# Altium schematic sheet [03] - POWER.SchDoc
size A3; DocumentNumber: 3; SheetNumber: 3; SheetTotal: 5
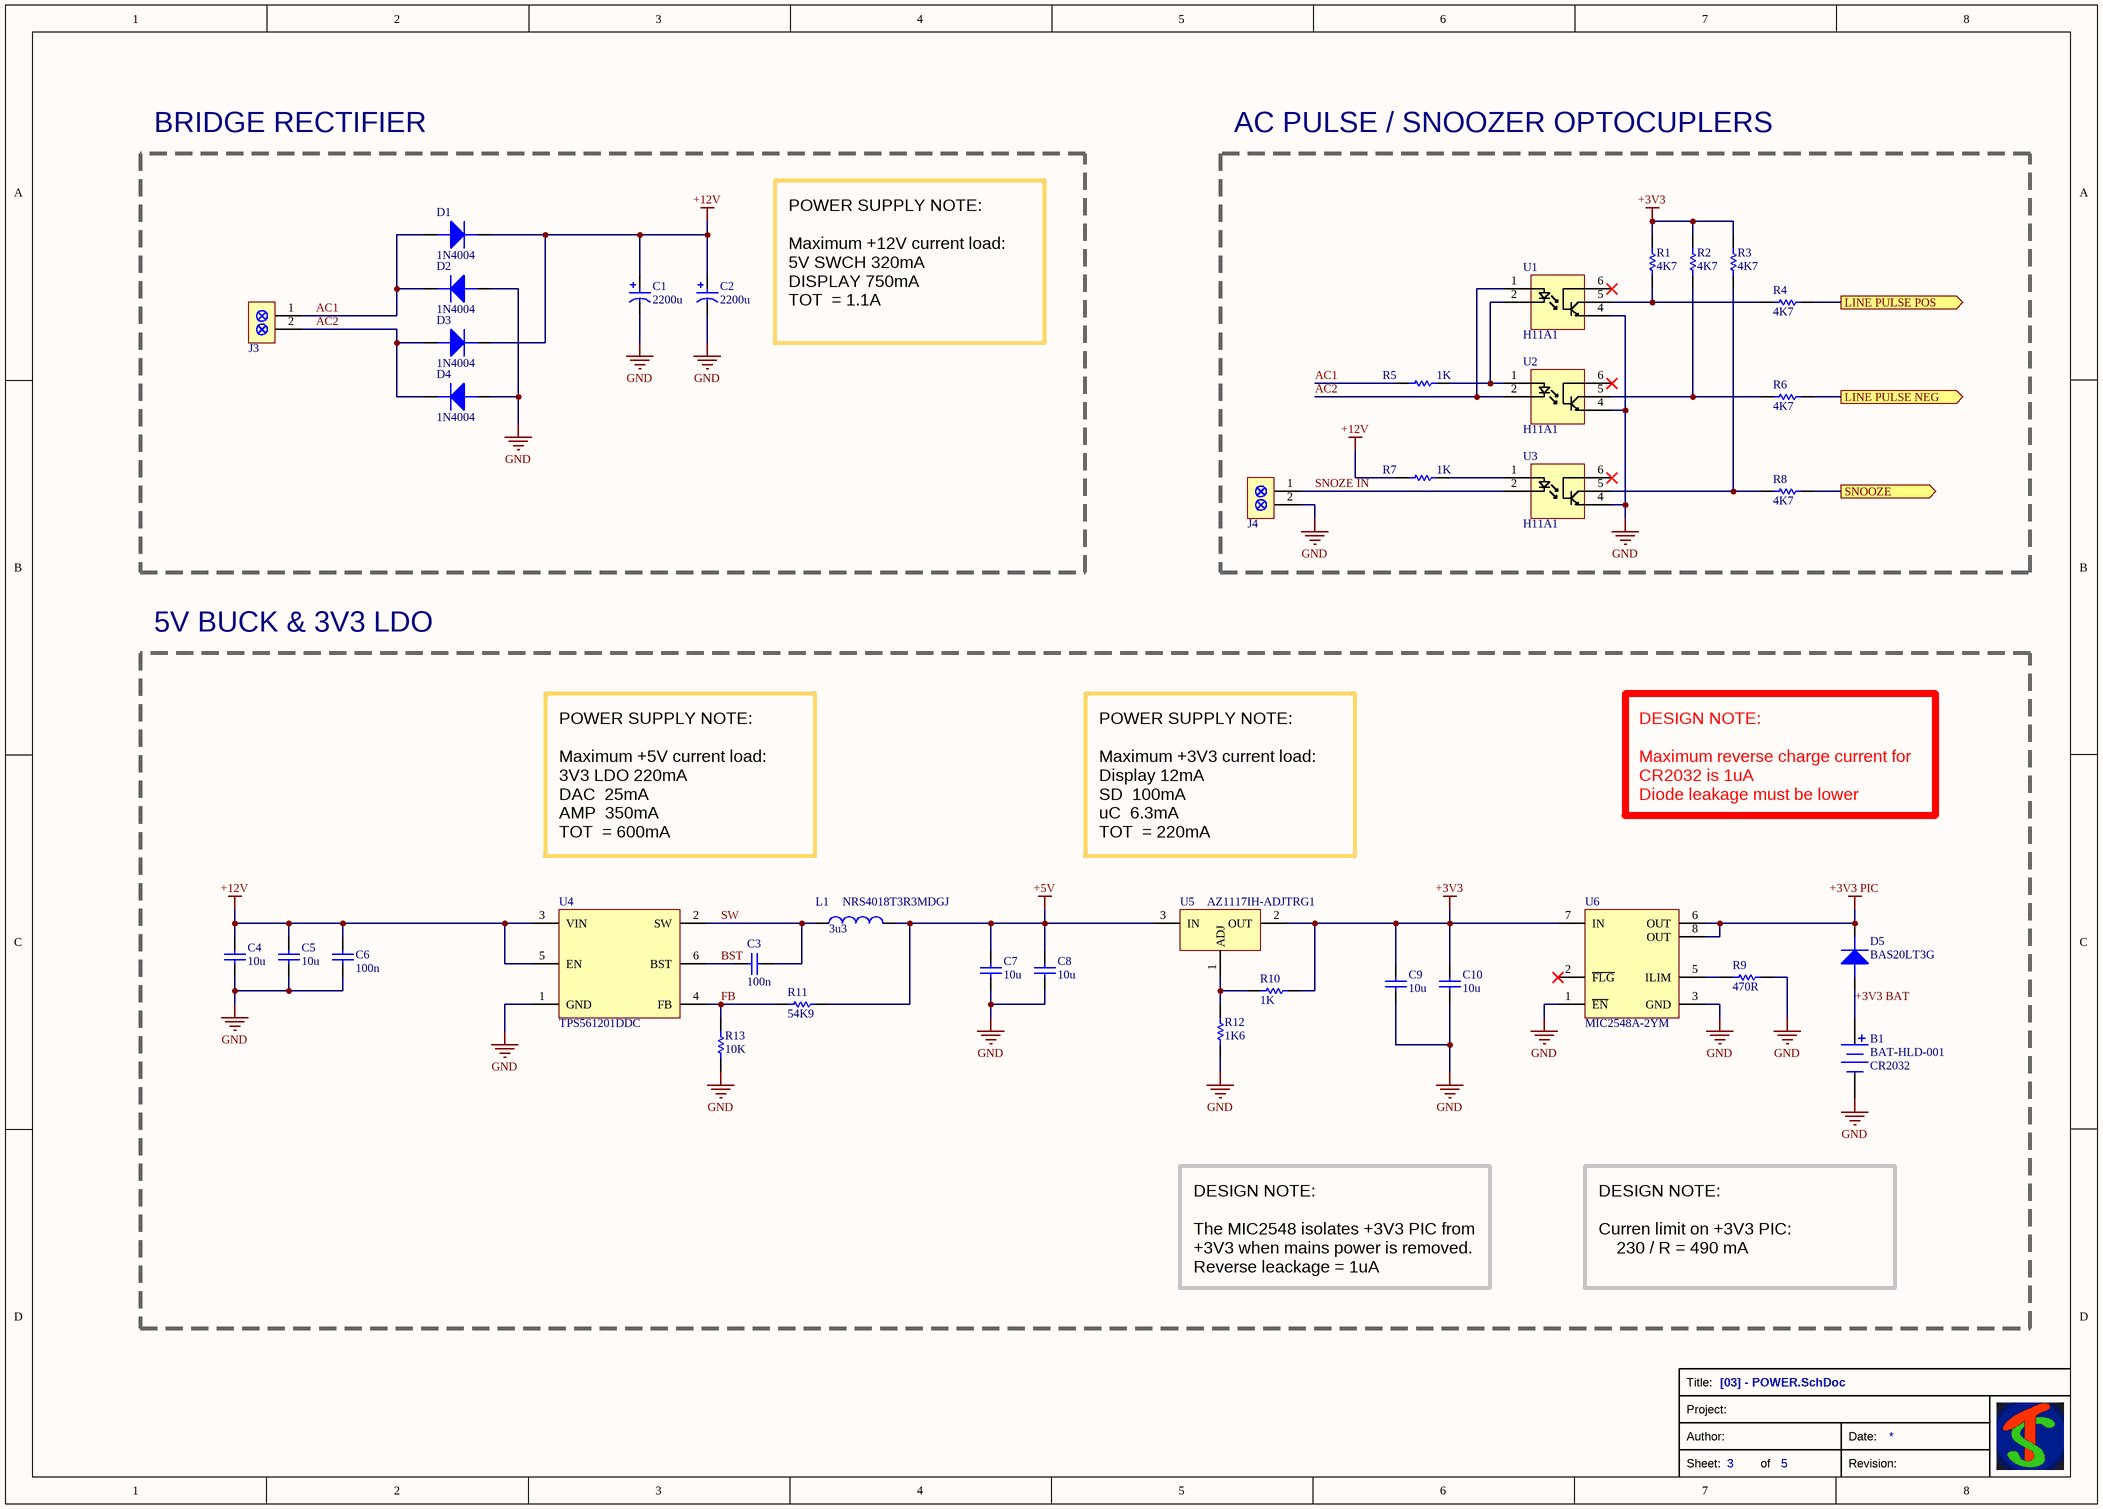
[diagram p0: [03] - POWER.SchDoc]

## Parts
B1  BAT-HLD-001  Size: CR2032  [BATHLD001-CR2032]
C1  value 2200u  [CAPPRD500W60D1300H2700]  (hidden comment: ESK228M025AL4AA)
C2  value 2200u  [CAPPRD500W60D1300H2700]  (hidden comment: ESK228M025AL4AA)
C3  value 100n  [CAP-0603]  (hidden comment: C0603C104M4RAC)
C4  value 10u  [CAP-0805]  (hidden comment: CL21A106KAYNNN)
C5  value 10u  [CAP-0805]  (hidden comment: CL21A106KAYNNN)
C6  value 100n  [CAP-0603]  (hidden comment: C0603C104M4RAC)
C7  value 10u  [CAP-0805]  (hidden comment: CL21A106KAYNNN)
C8  value 10u  [CAP-0805]  (hidden comment: CL21A106KAYNNN)
C9  value 10u  [CAP-0805]  (hidden comment: CL21A106KAYNNN)
C10  value 10u  [CAP-0805]  (hidden comment: CL21A106KAYNNN)
D1  1N4004  [DIODE-DO41]
D2  1N4004  [DIODE-DO41]
D3  1N4004  [DIODE-DO41]
D4  1N4004  [DIODE-DO41]
D5  BAS20LT3G  [SOT95P240X110-3N]
J3  SCREW-TH-BLOCK-200-2  [SCREW-TH-BLOCK-200-2]  (value not drawn)
J4  SCREW-TH-BLOCK-200-2  [SCREW-TH-BLOCK-200-2]  (value not drawn)
L1  NRS4018T3R3MDGJ  value 3u3  [INDP4040X18M]
R1  value 4K7  [RES-0603]  (hidden comment: RC0603FR-074K7L)
R2  value 4K7  [RES-0603]  (hidden comment: RC0603FR-074K7L)
R3  value 4K7  [RES-0603]  (hidden comment: RC0603FR-074K7L)
R4  value 4K7  [RES-0603]  (hidden comment: RC0603FR-074K7L)
R5  value 1K  [RES-0805]  (hidden comment: RC0805FR-071KL)
R6  value 4K7  [RES-0603]  (hidden comment: RC0603FR-074K7L)
R7  value 1K  [RES-0805]  (hidden comment: RC0805FR-071KL)
R8  value 4K7  [RES-0603]  (hidden comment: RC0603FR-074K7L)
R9  value 470R  [RES-0603]  (hidden comment: RC0603FR-07470RL)
R10  value 1K  [RES-0603]  (hidden comment: RC0603FR-071KL)
R11  value 54K9  [RES-0603]  (hidden comment: RC0603FR-0754K9L)
R12  value 1K6  [RES-0603]  (hidden comment: RC0603FR-071K6L)
R13  value 10K  [RES-0603]  (hidden comment: RC0603FR-0710KL)
U1  H11A1  [DIP762W51P254L889H508Q6N]
U2  H11A1  [DIP762W51P254L889H508Q6N]
U3  H11A1  [DIP762W51P254L889H508Q6N]
U4  TPS561201DDC  [SOT95P278X110-6N]
U5  AZ1117IH-ADJTRG1  [SOT230P700X180-4M]
U6  MIC2548A-2YM  [SOIC127P600X175-8N]

## Blocks framed on the sheet
BRIDGE RECTIFIER: C1 C2 D1-D4 J3
AC PULSE / SNOOZER OPTOCUPLERS: J4 R1-R8 U1-U3
5V BUCK & 3V3 LDO: B1 C3-C10 D5 L1 R9-R13 U4-U6

## Ports
LINE PULSE NEG (out), LINE PULSE POS (out), SNOOZE (out)

## Nets
+3V3: C9.1 C10.1 R1.2 R2.2 R3.2 R10.2 U5.2(OUT) U6.7(IN)
+3V3 PIC: D5.3(C) U6.6(OUT) U6.8(OUT)
+5V: C7.1 C8.1 L1.2 R11.2 U5.3(IN)
+12V: C1.1(P) C2.1(P) C4.1 C5.1 C6.1 D1.K(C) D3.K(C) R7.2 U4.3(VIN) U4.5(EN)
GND: B1.2(-) C1.2(N) C2.2(N) C4.2 C5.2 C6.2 C7.2 C8.2 C9.2 C10.2 D2.A D4.A J4.2 R9.2 R12.1 R13.1 U1.4(E) U2.4(E) U3.4(E) U4.1(GND) U6.1(~{EN}) U6.3(GND)
+3V3 BAT: B1.1(+) D5.1(A)
AC1: D1.A D2.K(C) J3.1 R5.2
AC2: D3.A D4.K(C) J3.2 U1.1(A) U2.2(K)
BST: C3.2 U4.6(BST)
FB: R11.1 R13.2 U4.4(FB)
LINE PULSE NEG: R6.1 ; port LINE PULSE NEG
LINE PULSE POS: R4.1 ; port LINE PULSE POS
SNOOZE: R8.1 ; port SNOOZE
SNOZE IN: J4.1 U3.2(K)
SW: C3.1 L1.1 U4.2(SW)
NetR1_1: R1.1 R4.2 U1.5(C)
NetR2_1: R2.1 R6.2 U2.5(C)
NetR3_1: R3.1 R8.2 U3.5(C)
NetR5_1: R5.1 U1.2(K) U2.1(A)
NetR7_1: R7.1 U3.1(A)
NetR9_1: R9.1 U6.5(ILIM)
NetR10_1: R10.1 R12.2 U5.1(ADJ)

Not connected (* = marked no-connect by the designer): U1 6(B)*; U2 6(B)*; U3 6(B)*; U6 2(~{FLG})*

## Notes on the sheet
- POWER SUPPLY NOTE:
  Maximum +12V current load:
  5V SWCH	320mA
  DISPLAY	750mA
  TOT 	= 1.1A
- POWER SUPPLY NOTE:
  Maximum +5V current load:
  3V3 LDO	220mA
  DAC 	25mA
  AMP 	350mA
  TOT 	= 600mA
- POWER SUPPLY NOTE:
  Maximum +3V3 current load:
  Display	12mA
  SD 	100mA
  uC 	6.3mA
  TOT 	= 220mA
- DESIGN NOTE:
  Maximum reverse charge current for CR2032 is 1uA
  Diode leakage must be lower
- DESIGN NOTE:
  The MIC2548 isolates +3V3 PIC from +3V3 when mains power is removed.
  Reverse leackage = 1uA
- DESIGN NOTE:
  Curren limit on +3V3 PIC:
  230 / R = 490 mA
- Title:
- Project:
- Sheet:
- Author:
- of
- Revision:
- Date:

## Library data of the parts
B1 = CR2032-SMD-BAT-HLD-001: Portabatterie a celle a bottone Linx CR2032 Battery Holder; Supplier 1: Mouser; Supplier Part Number 1: 712-BAT-HLD-001
C1 C2 = CAP-RADIAL-2200u-25V-ALU-20%: ALU 25V 2200uF  RippleCurrent=1.3A 20%; Manufacturer: KEMET; Voltage Rating: 25V; Tolerance: 20%; Dielectric: ALU; Supplier 1: Mouser; Supplier Part Number 1: 80-ESK228M025AL4AA
C3 C6 = CAP-0603-100n-16V-X7R-20%: MLCC - SMD 16V 100nF X7R 0603 20%; Manufacturer: KEMET; Tolerance: 20%; Dielectric: X7R; Supplier 1: Mouser; Supplier Part Number 1: 80-C0603C104M4RAC; Voltage Rating: 16V
C4 C5 C7-C10 = CAP-0805-10u-25V-X5R-10%: MLCC - SMD 25V 10uF X5R 10%; Manufacturer: Samsung; Voltage Rating: 25; Tolerance: 10%; Dielectric: X5R; Supplier 1: Mouser; Supplier Part Number 1: 187-CL21A106KAYNNNE
D1-D4 = DIODE-1N4004-T: Silicon Diode - 400V 50uA 1A; Reverse Voltage: 400V; Forward Current: 1A; Leakage Current: 50uA; Supplier 1: Mouser; Supplier Part Number 1: 621-1N4004
D5 = DIODE-BAS20LT3G: Silicon Diode - 200V 0.1uA 200mA; Leakage Current: 100nA; Reverse Recovery Time: 50nS; Reverse Voltage: 200V; Forward Current: 200mA; Supplier 1: Mouser; Supplier Part Number 1: 863-BAS20LT3G
J3 J4 = SCREW-TH-BLOCK-200-2: Screw Therminal Block 200 mil Pitch 2 Contacts
L1 = IND-4018-3u3-NRS4018T3R3MDGJ: Fixed Inductor 4018 3.3uH 66mOhms +/-20%Tol 2300mA; Manufacturer: Taiyo Yuden; Tolerance: 20%; Max DC Current: 2.3A; Max DC Resistance: 66m; Supplier 1: Mouser; Supplier Part Number 1: 963-NRS4018T3R3MDGJ
R1-R4 R6 R8 = RES-0603-4K7-1/10W-1%: Thick Film - SMD 75V 1/10W 4.7K ohm 0603 1%; Manufacturer: Yageo; Power Rating: 1/10W; Voltage Rating: 75V; Tolerance: 1%; Supplier 1: Mouser; Supplier 2: Mouser; Supplier 3: Mouser; Supplier Part Number 3: 603-RC0603FR-134K7L; Supplier Part Number 2: 603-RC0603FR-104K7L; Supplier Part Number 1: 603-RC0603FR-074K7L
R5 R7 = RES-0805-1K-1/8W-1%: Thick Film - SMD 150V 1/8W 1K ohm 0805 1%; Manufacturer: Yageo; Power Rating: 1/8W; Voltage Rating: 150V; Tolerance: 1%; Supplier 1: Mouser; Supplier 2: Mouser; Supplier 3: Mouser; Supplier Part Number 3: 603-RC0805FR-131KL; Supplier Part Number 2: 603-RC0805FR-101KL; Supplier Part Number 1: 603-RC0805FR-071KL
R9 = RES-0603-470-1/10W-1%: Thick Film - SMD 75V 1/10W 470 ohm 0603 1%; Manufacturer: Yageo; Power Rating: 1/10W; Voltage Rating: 75V; Tolerance: 1%; Supplier 1: Mouser; Supplier 2: Mouser; Supplier 3: Mouser; Supplier Part Number 3: 603-RC0603FR-13470RL; Supplier Part Number 2: 603-RC0603FR-10470RL; Supplier Part Number 1: 603-RC0603FR-07470RL
R10 = RES-0603-1K-1/10W-1%: Thick Film - SMD 75V 1/10W 1K ohm 0603 1%; Manufacturer: Yageo; Power Rating: 1/10W; Voltage Rating: 75V; Tolerance: 1%; Supplier 1: Mouser; Supplier 2: Mouser; Supplier 3: Mouser; Supplier Part Number 3: 603-RC0603FR-131KL; Supplier Part Number 2: 603-RC0603FR-101KL; Supplier Part Number 1: 603-RC0603FR-071KL
R11 = RES-0603-54K9-1/10W-1%: Thick Film - SMD 75V 1/10W 54.9K ohm 0603 1%; Manufacturer: Yageo; Power Rating: 1/10W; Voltage Rating: 75V; Tolerance: 1%; Supplier 1: Mouser; Supplier 2: Mouser; Supplier Part Number 1: 603-RC0603FR-0754K9L; Supplier Part Number 2: 603-RC0603FR-1054K9L
R12 = RES-0603-1K6-1/10W-1%: Thick Film - SMD 75V 1/10W 1.6K ohm 0603 1%; Manufacturer: Yageo; Power Rating: 1/10W; Voltage Rating: 75V; Tolerance: 1%; Supplier 1: Mouser; Supplier 2: Mouser; Supplier 3: Mouser; Supplier Part Number 3: 603-RC0603FR-131K6L; Supplier Part Number 2: 603-RC0603FR-101K6L; Supplier Part Number 1: 603-RC0603FR-071K6L
R13 = RES-0603-10K-1/10W-1%: Thick Film - SMD 75V 1/10W 10K ohm 0603 1%; Manufacturer: Yageo; Power Rating: 1/10W; Voltage Rating: 75V; Tolerance: 1%; Supplier 1: Mouser; Supplier 2: Mouser; Supplier 3: Mouser; Supplier Part Number 2: 603-RC0603FR-1010KL; Supplier Part Number 1: 603-RC0603FR-0710KL; Supplier Part Number 3: 603-RC0603FR-1310KL
U1-U3 = OPTO-TH-H11A1: Optocoupler, Phototransistor Output, With Base Connection; Supplier 1: Mouser; Supplier Part Number 1: 782-H11A1
U4 = TPS561201DDC: 4.5-V to 17-V Input, 1-A Synchronous Step-Down Voltage Regulator; Supplier 1: Mouser; Supplier 2: Mouser; Supplier Part Number 2: 595-TPS561201DDCR; Supplier Part Number 1: 595-TPS561201DDCT
U5 = LDO-AZ1117IH-ADJ: LDO 15V Max 1.2V Dropout 1.35A Max; Vref: 1.25V; Minimum Load Current: 1.7mA; Supplier 1: Mouser; Supplier Part Number 1: 621-AZ1117IH-ADJTRG1; Input Voltage Maximum: 15V; Dropout Voltage: 1.2V; Current Limit: 1.35A
U6 = MIC2548A-2YM: Programmable Current-Limit High-Side Switch; Supplier 1: Mouser; Supplier Part Number 1: 998-MIC2548A-2YM